# EAGLE design temp-accel-chain (EAGLE 6.5.0)
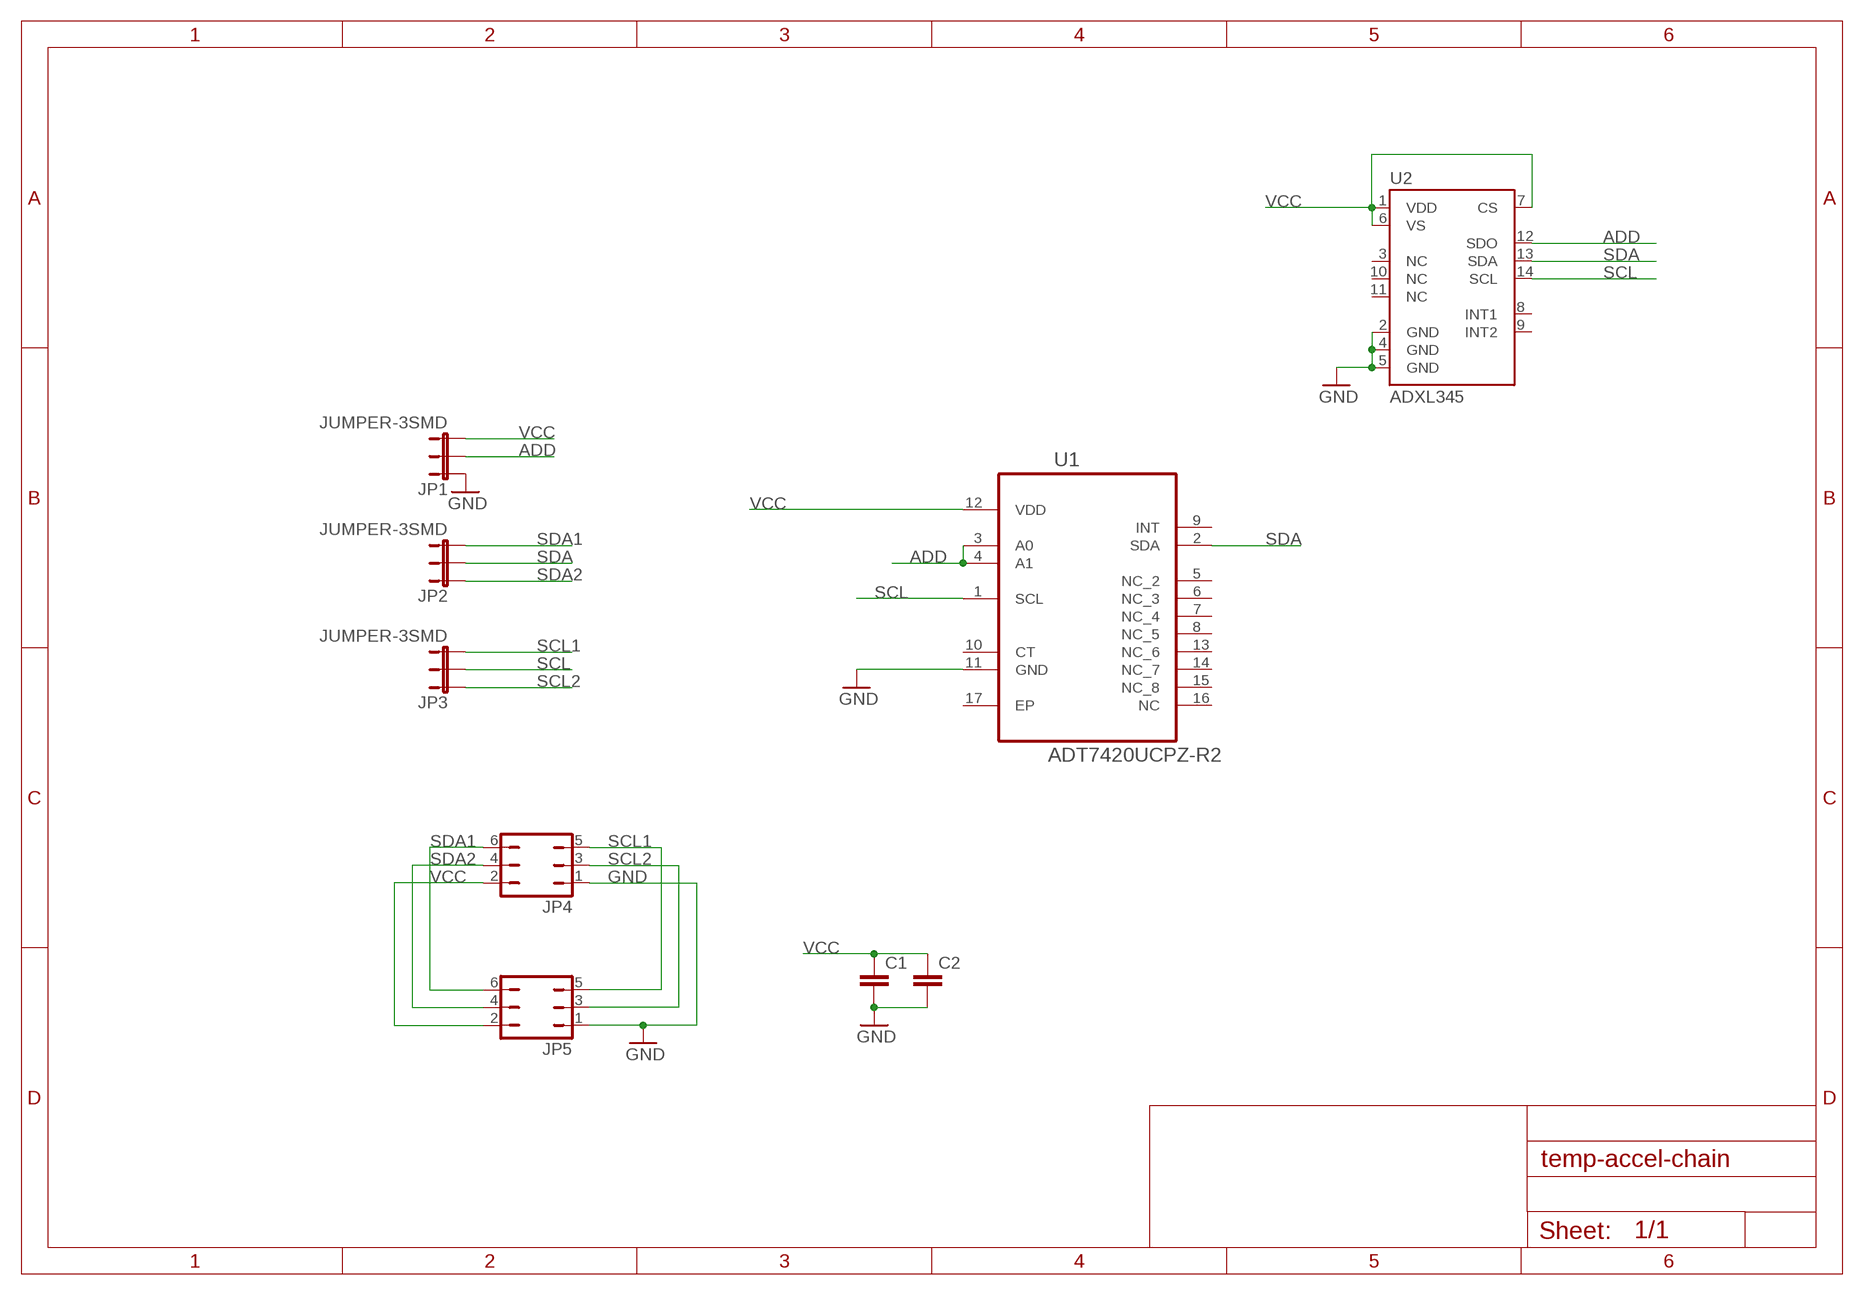
[diagram p0: schematic, sheet 1]

## Parts
C1  C-EUC0805  [C0805]
C2  C-EUC0805  [C0805]
JP1  JUMPER-3SMD  [SJ_3]
JP2  JUMPER-3SMD  [SJ_3]
JP3  JUMPER-3SMD  [SJ_3]
JP4  JP3Q  [JP3Q]
JP5  JP3Q  [JP3Q]
U1  ADT7420UCPZ-R2  [QFN65P400X400X80-17N]
U2  ADXL345  [LGA14]

## Nets
ADD: JP1.2 U1.3(A0) U1.4(A1) U2.12(SDO)
GND: C1.2 C2.2 JP1.1 JP4.1 JP5.1 U1.11(GND) U2.2(GND) U2.4(GND) U2.5(GND)
SCL: JP3.2 U1.1(SCL) U2.14(SCL)
SCL1: JP3.3 JP4.5 JP5.5
SCL2: JP3.1 JP4.3 JP5.3
SDA: JP2.2 U1.2(SDA) U2.13(SDA)
SDA1: JP2.3 JP4.6 JP5.6
SDA2: JP2.1 JP4.4 JP5.4
VCC: C1.1 C2.1 JP1.3 JP4.2 JP5.2 U1.12(VDD) U2.1(VDD) U2.6(VS) U2.7(CS)
Unconnected: U1.5(NC_2) U1.6(NC_3) U1.7(NC_4) U1.8(NC_5) U1.9(INT) U1.10(CT) U1.13(NC_6) U1.14(NC_7) U1.15(NC_8) U1.16(NC) U1.17(EP) U2.3(NC) U2.8(INT1) U2.9(INT2) U2.10(NC) U2.11(NC)

## Library data of the parts
C1 C2 = resistor:C-EU: CAPACITOR, European symbol
JP1-JP3 = SparkFun-Passives:JUMPER-3
JP4 JP5 = jumper:JP3Q: JUMPER
U1 = farnell-parts:ADT7420UCPZ-R2: TEMP SENSOR, 16BIT, +/-0.25C, 16LFCSP; MPN: ADT7420UCPZ-R2; OC_FARNELL: 2306581; OC_NEWARK: 66W1259; PACKAGE: 16LFCSP; SUPPLIER: ANALOG DEVICES
U2 = SparkFun-Sensors:ADXL345: 3-axis SPI/I2C 2/4/8/16g accelerometer

## Board
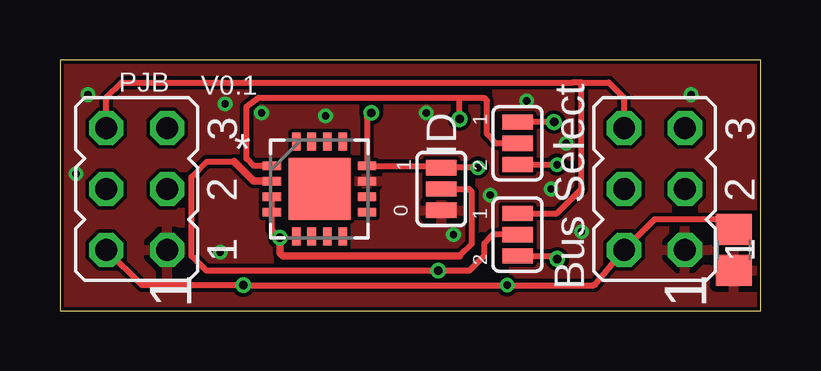
[diagram p1: board, top side]
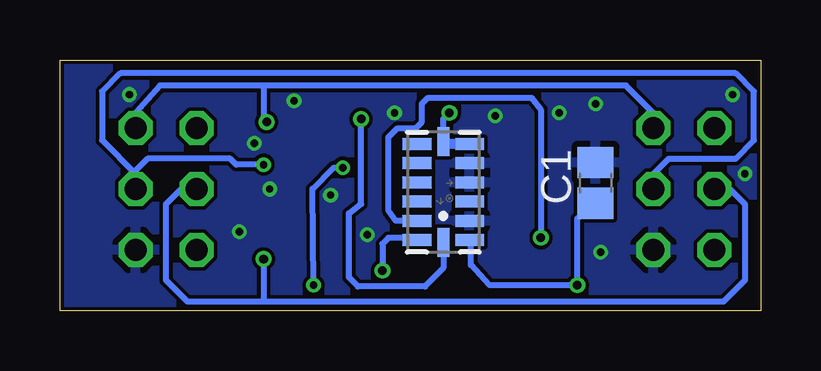
[diagram p2: board, bottom side, seen from below]

Size 29.22 x 10.46 mm. Coordinates in mm from the lower left corner, seen from the top.
Outline: 0,0 29.22,0 29.22,10.46 0,10.46 0,0
Copper layers (1*16): Top 0.035mm / dielectric 1.5mm / Bottom 0.035mm
Design rules "Hackvana": minimum track width 6mil, minimum drill 0.3mm, track to track 6mil, track to pad 6mil, pad to pad 6mil, via to via 6mil, smd to smd 0mil, copper to edge 6mil, drill to drill 6mil, minimum pad ring 10mil, minimum via ring 6mil, stop-mask expansion 2mil, vias tented up to drill 100mil, thermal gap 10mil

### Footprints (pad centres in the part's own frame; a part is rotated, then mirrored left to right if it is on the bottom)
C0805 = smd 1.3 x 1.5: 1 -0.85,0; 2 0.85,0
SJ_3 = smd 0.635 x 1.27: 1 -0.889,0; 2 0,0; 3 0.889,0
JP3Q = drill 0.914 octagon: 1 -2.54,-1.27; 2 -2.54,1.27; 3 0,-1.27; 4 0,1.27; 5 2.54,-1.27; 6 2.54,1.27
QFN65P400X400X80-17N = smd 0.762 x 0.356: 1 -1.981,0.965; 2 -1.981,0.33; 3 -1.981,-0.33; 4 -1.981,-0.965; 9 1.981,-0.965; 10 1.981,-0.33; 11 1.981,0.33; 12 1.981,0.965 | smd 0.356 x 0.762: 5 -0.965,-1.981; 6 -0.33,-1.981; 7 0.33,-1.981; 8 0.965,-1.981; 13 0.965,1.981; 14 0.33,1.981; 15 -0.33,1.981; 16 -0.965,1.981 | smd 2.591 x 2.591: 17 0,0
LGA14 = smd 0.5 x 1.2: 1 2,1.1; 2 1.2,1.1; 3 0.4,1.1; 4 -0.4,1.1; 5 -1.2,1.1; 6 -2,1.1; 8 -2,-1.1; 9 -1.2,-1.1; 10 -0.4,-1.1; 11 0.4,-1.1; 12 1.2,-1.1; 13 2,-1.1 | smd 1.2 x 0.5: 7 -2.1,0; 14 2.1,0

### Placement (x,y rotation side)
C1  6.88,5.33 90 bottom
C2  28.09,2.54 270 top
JP1  15.9,5.08 90 top
JP2  19.08,3.17 90 top
JP3  19.08,6.99 90 top
JP4  3.2,5.08 90 top
JP5  24.79,5.08 90 top
U1  10.82,5.08 0 top
U2  13.23,4.95 270 bottom

### Tracks (layer width: path | path; a pad name or v marks a point on that pad's centre or on a via)
ADD  (via drill 0.36 pad 0.51)
  Top 0.254: U1.3 U1.4 8.84,3.38 v9.17,3.05 | JP1.2 17.04,5.08 17.17,4.95 17.17,2.79 16.66,2.29
  Top 0.305: 16.66,2.29 9.3,2.29 9.17,2.41 v9.17,3.05
  Bottom 0.254: U2.12 15.21,3.75 15.52,4.19 15.52,7.24 15.14,7.62 14.38,7.62 14.12,7.87 14.12,8.64 13.87,8.89 9.55,8.89 9.17,8.38 v9.17,3.05
GND  (via drill 0.3 pad 0.51)
  other vias: 20.47,5.08 6.68,2.44 0.66,5.71 8.41,8.26 1.17,9.02 21.11,6.99 26.31,9.02 15.27,8.26 11.07,8.13 17.93,4.83 21.74,3.3 19.46,8.76 6.88,8.64 16.41,3.17
  pour Top: -1.37,11.43 30.51,11.43 30.51,-1.27 -1.37,-1.27
  pour Bottom: -0.99,10.79 29.36,10.92 29.36,-0.38 -0.99,-0.51
SCL  (via drill 0.36 pad 0.51)
  Top 0.254: U1.1 8.08,6.04 7.77,6.35 7.77,8.51 8.28,8.89 16.66,8.89 | 16.66,8.89 17.68,8.89 17.81,8.76 17.81,7.37 18.19,6.99 JP3.2 | v16.66,8 16.66,8.89
  Bottom 0.254: U2.14 13.23,1.78 14,1.02 16.79,1.02 17.17,1.4 17.17,4.06 16.66,4.45 v16.66,8
SCL1  (via drill 0.36 pad 0.51)
  Top 0.254: v20.6,7.87 JP3.3
  Bottom 0.254: JP4.5 4.47,8.26 5.61,9.4 20.73,9.4 | 20.73,9.4 25.04,9.4 26.06,8.26 JP5.5 | 20.73,9.4 20.73,8 v20.6,7.87
SCL2  (via drill 0.3 pad 0.51)
  Top 0.254: JP3.1 v20.73,6.1
  Bottom 0.254: v20.73,6.1 21.87,6.1 22.12,6.35 25.55,6.35 26.06,5.84 26.06,5.71 | 26.06,5.71 JP5.3 | JP4.3 4.47,5.71 3.84,6.35 1.04,6.35 0.28,7.11 0.28,9.14 1.04,9.91 26.7,9.91 27.46,9.14 27.46,7.11 26.06,5.71
SDA  (via drill 0.36 pad 0.41)
  Top 0.254: JP2.2 18.06,3.17 17.68,2.79 17.68,2.29 17.07,1.68 v15.77,1.68 6.1,1.68 5.49,2.29 5.49,5.59 6.12,6.22 7.26,6.22
  Top 0.305: U1.2 8.08,5.41 7.26,6.22
  Bottom 0.254: U2.13 14.43,3.05 15.52,3.05 15.77,2.79 v15.77,1.68
SDA1
  Top 0.254: JP4.6 1.93,8.89 2.57,9.53 21.36,9.53 21.74,9.53 | 21.74,9.53 22.89,9.53 23.52,8.89 JP5.6 | JP2.3 20.73,4.06 21.74,5.08 21.74,9.53
SDA2  (via drill 0.36 pad 0.51)
  Top 0.254: JP2.1 20.6,2.29 v20.73,2.16
  Bottom 0.254: JP4.4 1.3,5.08 0.66,4.45 0.66,1.27 1.55,0.38 20.73,0.38 | 20.73,0.38 23.9,0.38 24.79,1.27 24.79,4.45 24.16,5.08 JP5.4 | v20.73,2.16 20.73,0.38
VCC  (via drill 0.3 pad 0.51, 0.36 pad 0.51)
  Top 0.254: v17.42,5.97 JP1.3 15.82,6.04 U1.12 12.8,8.08 v12.98,8.26 | JP4.2 3.43,1.07 v7.65,1.07 v18.64,1.07 22.28,1.07 JP5.2 24.79,3.81 27.46,3.81 28.09,3.17 C2.1
  Bottom 0.254: 12.09,2.91 12.09,1.91 11.3,1.07 v7.65,1.07 7.65,3.85 C1.1 | 13.23,6.95 13.23,8 v12.98,8.26 | v18.64,1.07 18.69,5.08 17.81,5.97 v17.42,5.97
  Bottom 0.406: U2.6 13.23,6.95 U2.7 | 12.09,2.91 U2.1

### Text on the board
tNames: PJB | V0.1 | 1 | 1 | ID | 2 | 0 | 1 | 2 | Bus Select | 1 | 1